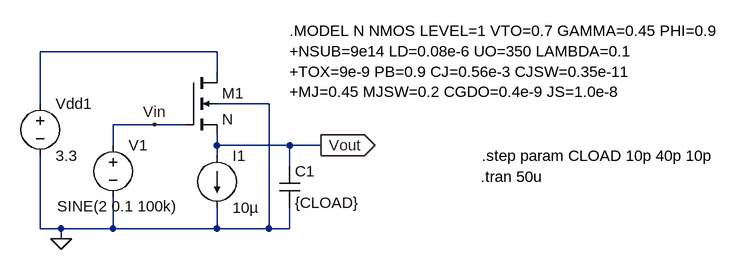
[diagram p0: schematic SourceFollower-CapacitiveLoad.asc]
SourceFollower-CapacitiveLoad.asc, the LTspice schematic file:
Version 4
SHEET 1 880 680
WIRE 16 32 -256 32
WIRE 16 64 16 32
WIRE -256 112 -256 32
WIRE 96 112 16 112
WIRE -80 144 -144 144
WIRE -32 144 -80 144
WIRE -144 176 -144 144
WIRE 16 176 16 160
WIRE 128 176 16 176
WIRE 176 176 128 176
WIRE 16 192 16 176
WIRE 128 208 128 176
WIRE -256 304 -256 192
WIRE -224 304 -256 304
WIRE -144 304 -144 256
WIRE -144 304 -224 304
WIRE 16 304 16 272
WIRE 16 304 -144 304
WIRE 96 304 96 112
WIRE 96 304 16 304
WIRE 128 304 128 272
WIRE 128 304 96 304
WIRE -224 320 -224 304
FLAG -224 320 0
FLAG 176 176 Vout
IOPIN 176 176 Out
FLAG -80 144 Vin
SYMBOL nmos4 -32 64 R0
SYMATTR InstName M1
SYMATTR Value N
SYMATTR Value2 l=4u w=1u
SYMBOL voltage -256 96 R0
WINDOW 123 0 0 Left 0
WINDOW 39 0 0 Left 0
SYMATTR InstName Vdd1
SYMATTR Value 3.3
SYMBOL voltage -144 160 R0
WINDOW 123 24 124 Left 2
WINDOW 39 0 0 Left 0
WINDOW 3 -86 110 Left 2
SYMATTR InstName V1
SYMATTR Value SINE(2 0.1 100k)
SYMBOL current 16 192 R0
WINDOW 123 0 0 Left 0
WINDOW 39 0 0 Left 0
SYMATTR InstName I1
SYMATTR Value 10µ
SYMBOL cap 112 208 R0
SYMATTR InstName C1
SYMATTR Value {CLOAD}
TEXT 128 0 Left 2 !.MODEL N NMOS LEVEL=1 VTO=0.7 GAMMA=0.45 PHI=0.9\n+NSUB=9e14 LD=0.08e-6 UO=350 LAMBDA=0.1\n+TOX=9e-9 PB=0.9 CJ=0.56e-3 CJSW=0.35e-11\n+MJ=0.45 MJSW=0.2 CGDO=0.4e-9 JS=1.0e-8
TEXT 424 192 Left 2 !.step param CLOAD 10p 40p 10p
TEXT 422 224 Left 2 !.tran 50u

The netlist it stands for:
* SourceFollower-CapacitiveLoad.asc
M1 N001 Vin Vout 0 N l=4u w=1u
Vdd1 N001 0 3.3
V1 Vin 0 SINE(2 0.1 100k)
I1 Vout 0 10µ
C1 Vout 0 {CLOAD}
.model NMOS NMOS
.model PMOS PMOS
.lib standard.mos
.MODEL N NMOS LEVEL=1 VTO=0.7 GAMMA=0.45 PHI=0.9
+NSUB=9e14 LD=0.08e-6 UO=350 LAMBDA=0.1
+TOX=9e-9 PB=0.9 CJ=0.56e-3 CJSW=0.35e-11
+MJ=0.45 MJSW=0.2 CGDO=0.4e-9 JS=1.0e-8
.step param CLOAD 10p 40p 10p
.tran 50u
.backanno
.end